# EAGLE design quad-esc (EAGLE 5.11)
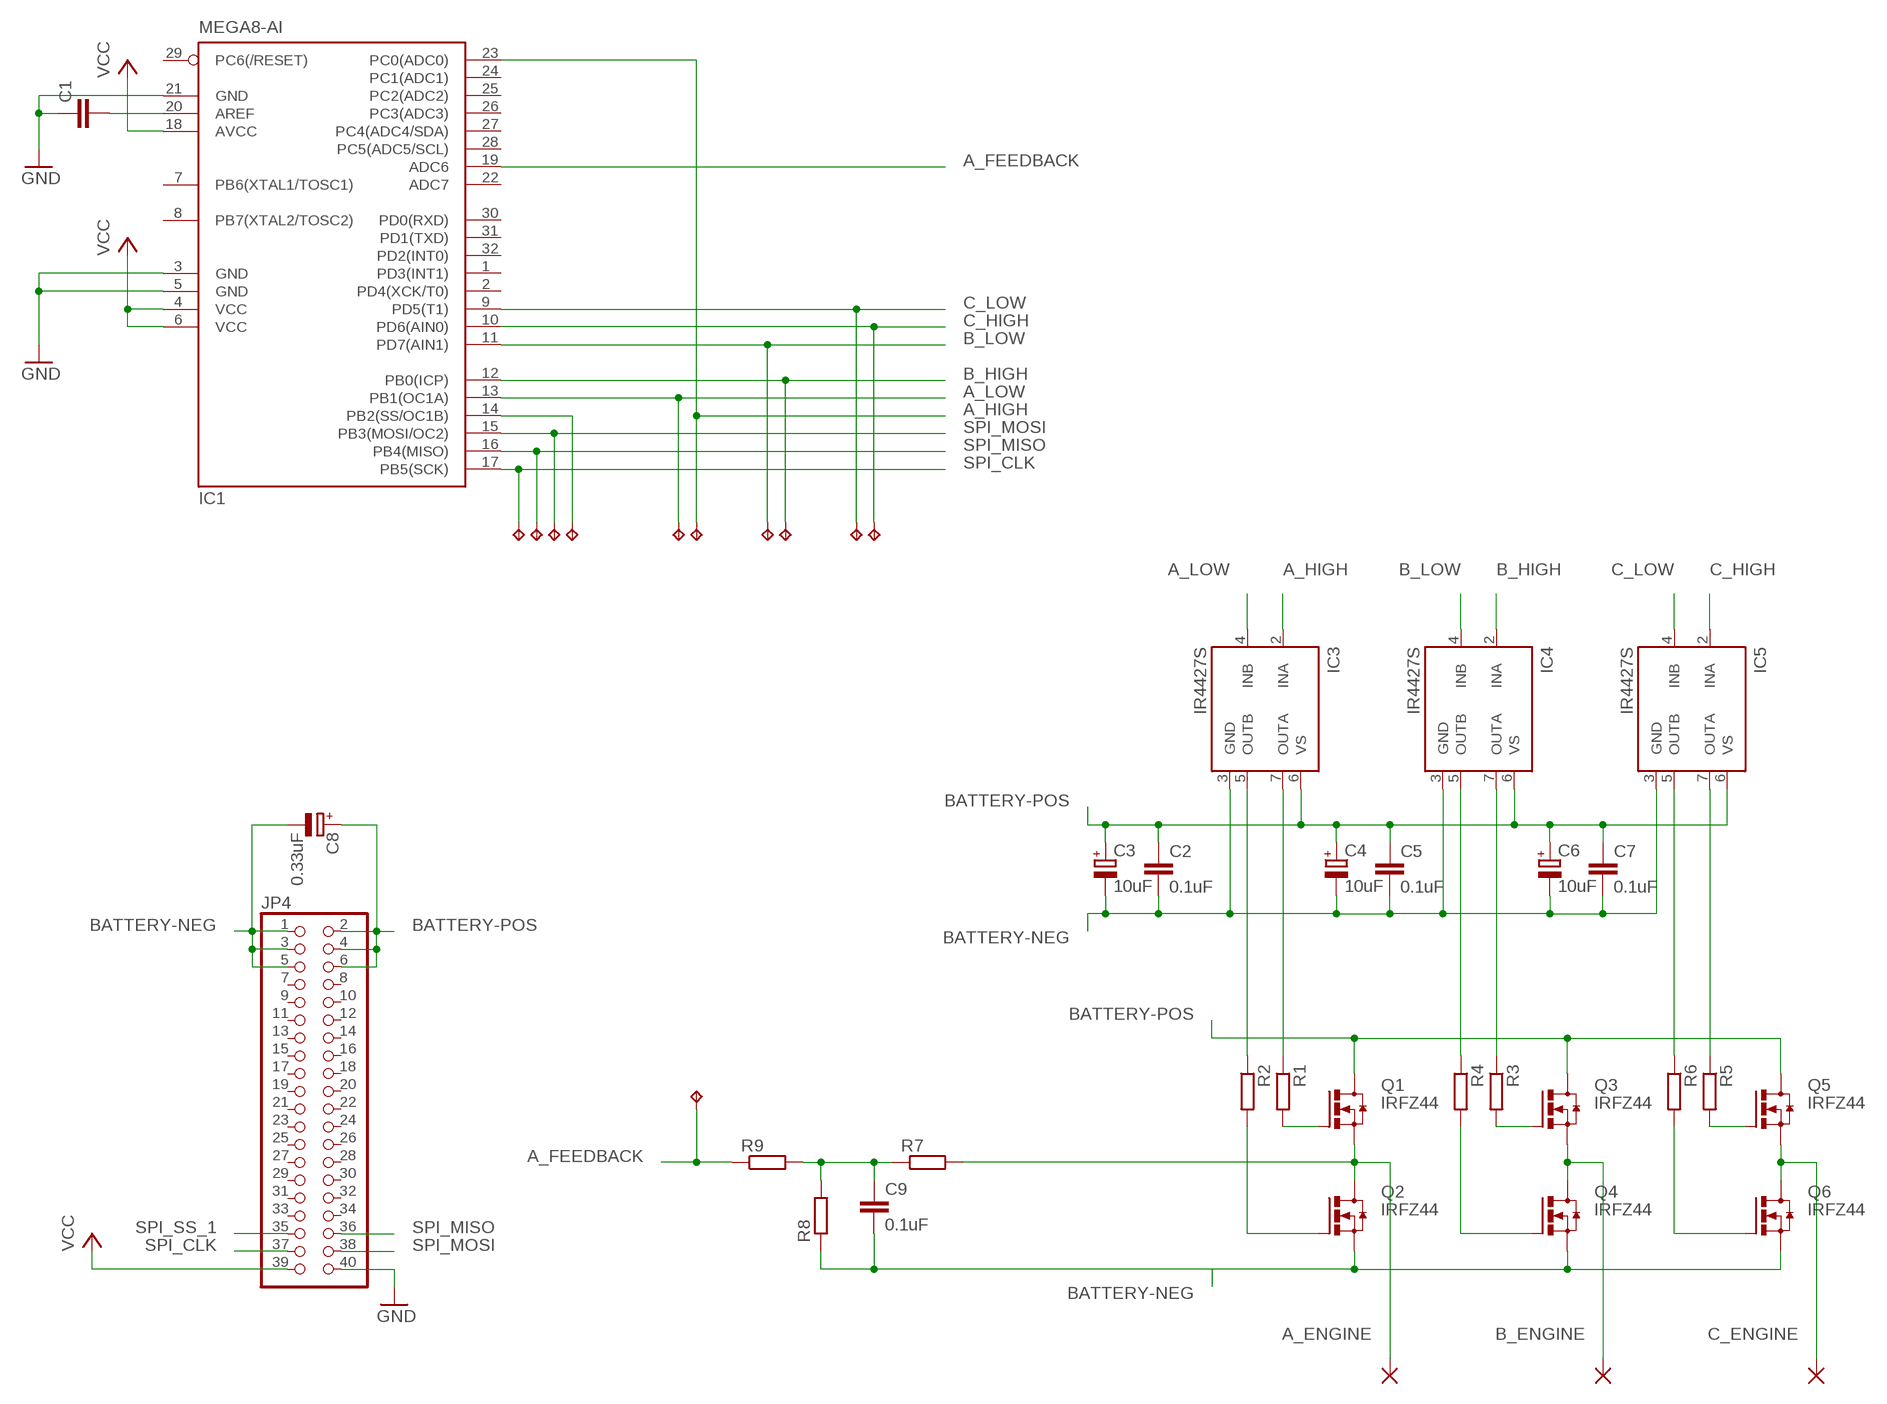
[diagram p0: schematic, sheet 1]

## Parts
A_ENGINE  WIREPADSMD2,54-5,08  [SMD2,54-5,08]
B_ENGINE  WIREPADSMD2,54-5,08  [SMD2,54-5,08]
C1  C-EUC1206  [C1206]
C2  0.1uF  C-EUC0805  [C0805]
C3  10uF  CPOL-EUSMCA  [SMC_A]
C4  10uF  CPOL-EUSMCA  [SMC_A]
C5  0.1uF  C-EUC0805  [C0805]
C6  10uF  CPOL-EUSMCA  [SMC_A]
C7  0.1uF  C-EUC0805  [C0805]
C8  0.33uF  CPOL-EUSMCA  [SMC_A]
C9  0.1uF  C-EUC0805  [C0805]
C_ENGINE  WIREPADSMD2,54-5,08  [SMD2,54-5,08]
IC1  MEGA8-AI  [TQFP32-08]
IC3  IR4427S  [SO08]
IC4  IR4427S  [SO08]
IC5  IR4427S  [SO08]
JP4  PINHD-2X20  [2X20]
Q1  IRFZ44  [TO220BV]
Q2  IRFZ44  [TO220BV]
Q3  IRFZ44  [TO220BV]
Q4  IRFZ44  [TO220BV]
Q5  IRFZ44  [TO220BV]
Q6  IRFZ44  [TO220BV]
R1  R-EU_R1206  [R1206]
R2  R-EU_R1206  [R1206]
R3  R-EU_R1206  [R1206]
R4  R-EU_R1206  [R1206]
R5  R-EU_R1206  [R1206]
R6  R-EU_R1206  [R1206]
R7  R-EU_R1206  [R1206]
R8  R-EU_R1206  [R1206]
R9  R-EU_R1206  [R1206]
TP1  TPPAD1-13  [P1-13]
TP2  TPPAD1-13  [P1-13]
TP3  TPPAD1-13  [P1-13]
TP4  TPPAD1-13  [P1-13]
TP5  TPPAD1-13  [P1-13]
TP6  TPPAD1-13  [P1-13]
TP7  TPPAD1-13  [P1-13]
TP8  TPPAD1-13  [P1-13]
TP9  TPPAD1-13  [P1-13]
TP10  TPPAD1-13  [P1-13]
TP11  TPPAD1-13  [P1-13]

## Nets
A_ENGINE: A_ENGINE.1(P) Q1.3(S) Q2.2(D) R7.2
A_FEEDBACK: IC1.19(ADC6) R9.1 TP7.TP
A_HIGH: IC1.23(PC0(ADC0)) IC3.2(INA) TP2.TP
A_LOW: IC1.13(PB1(OC1A)) IC3.4(INB) TP1.TP
B_ENGINE [battery]: B_ENGINE.1(P) Q3.3(S) Q4.2(D)
B_HIGH: IC1.12(PB0(ICP)) IC4.2(INA) TP4.TP
B_LOW: IC1.11(PD7(AIN1)) IC4.4(INB) TP3.TP
BATTERY-NEG: C2.2 C3.- C4.- C5.2 C6.- C7.2 C8.- C9.2 IC3.3(GND) IC4.3(GND) IC5.3(GND) JP4.1 JP4.3 JP4.5 Q2.3(S) Q4.3(S) Q6.3(S) R8.1
BATTERY-POS: C2.1 C3.+ C4.+ C5.1 C6.+ C7.1 C8.+ IC3.6(VS) IC4.6(VS) IC5.6(VS) JP4.2 JP4.4 JP4.6 Q1.2(D) Q3.2(D) Q5.2(D)
C_ENGINE [battery]: C_ENGINE.1(P) Q5.3(S) Q6.2(D)
C_HIGH: IC1.10(PD6(AIN0)) IC5.2(INA) TP6.TP
C_LOW: IC1.9(PD5(T1)) IC5.4(INB) TP5.TP
GND: C1.1 IC1.3(GND) IC1.5(GND) IC1.21(GND) JP4.40
N$1: C1.2 IC1.20(AREF)
N$2: Q4.1(G) R4.2
N$3: Q3.1(G) R3.2
N$4: IC3.5(OUTB) R2.1
N$5: C9.1 R7.1 R8.2 R9.2
N$7: IC4.5(OUTB) R4.1
N$8: IC4.7(OUTA) R3.1
N$11: IC5.5(OUTB) R6.1
N$12: IC5.7(OUTA) R5.1
N$14: IC3.7(OUTA) R1.1
N$15: Q2.1(G) R2.2
N$16: Q5.1(G) R5.2
N$17: Q6.1(G) R6.2
N$18: Q1.1(G) R1.2
SPI_CLK: IC1.17(PB5(SCK)) JP4.37 TP8.TP
SPI_MISO: IC1.16(PB4(MISO)) JP4.36 TP9.TP
SPI_MOSI: IC1.15(PB3(MOSI/OC2)) JP4.38 TP10.TP
SPI_SS_1: IC1.14(PB2(SS/OC1B)) JP4.35 TP11.TP
VCC: IC1.4(VCC) IC1.6(VCC) IC1.18(AVCC) JP4.39
Unconnected: IC1.1(PD3(INT1)) IC1.2(PD4(XCK/T0)) IC1.7(PB6(XTAL1/TOSC1)) IC1.8(PB7(XTAL2/TOSC2)) IC1.22(ADC7) IC1.24(PC1(ADC1)) IC1.25(PC2(ADC2)) IC1.26(PC3(ADC3)) IC1.27(PC4(ADC4/SDA)) IC1.28(PC5(ADC5/SCL)) IC1.29(PC6(/RESET)) IC1.30(PD0(RXD)) IC1.31(PD1(TXD)) IC1.32(PD2(INT0)) JP4.7 JP4.8 JP4.9 JP4.10 JP4.11 JP4.12 JP4.13 JP4.14 JP4.15 JP4.16 JP4.17 JP4.18 JP4.19 JP4.20 JP4.21 JP4.22 JP4.23 JP4.24 JP4.25 JP4.26 JP4.27 JP4.28 JP4.29 JP4.30 JP4.31 JP4.32 JP4.33 JP4.34

## Library data of the parts
A_ENGINE B_ENGINE C_ENGINE = wirepad:WIREPAD: Wire PAD connect wire on PCB
C1 = rcl:C-EU: CAPACITOR, European symbol
C2 C5 C7 C9 = resistor:C-EU: CAPACITOR, European symbol
C3 C4 C6 C8 = resistor:CPOL-EU: POLARIZED CAPACITOR, European symbol
IC1 = atmel:MEGA8: MICROCONTROLLER 8 Kbytes FLASH, 1 kbytes SRAM, 512 bytes EEPROM, USART, 6-channel 10 bit ADC, 2-channel 8 bit ADC Pin compatible with Atmega48, ATMega88, ATMega168 Source: avr.lbr; MPN: ATMEGA8-16AU; OC_FARNELL: 9171371; OC_NEWARK: 73M8863
IC3-IC5 = ir:IR4427: DUAL LOW SIDE DRIVER Source: ID4426.pdf; MF: INTERNATIONAL RECTIFIER(IR); MPN: IR4427STRPBF; OC_FARNELL: 8639094; OC_NEWARK: 63J7933
JP4 = pinhead:PINHD-2X20: PIN HEADER
Q1-Q6 = irf:IRFZ44: 50A, 60V, N-Channel Power MOSFET
R1-R9 = resistor:R-EU_: RESISTOR, European symbol
TP1-TP11 = testpad:TP: Test pad

## Net classes
0 default: drill 0.61 mm
1 battery: width 1.27 mm

## Board
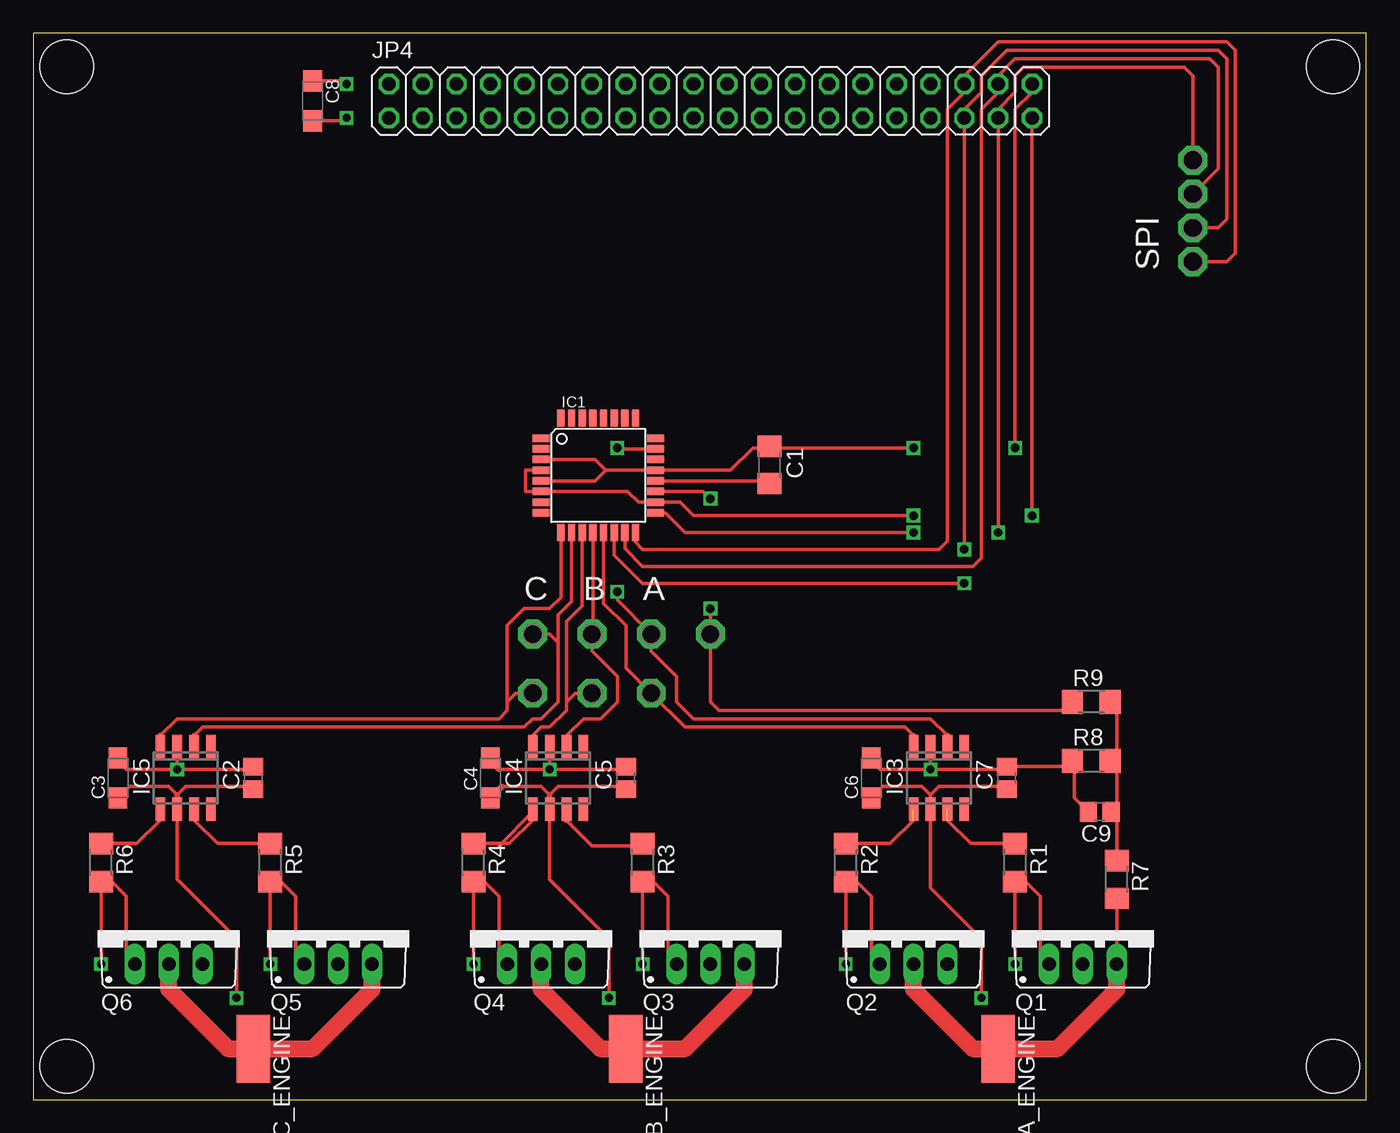
[diagram p1: board, top side]
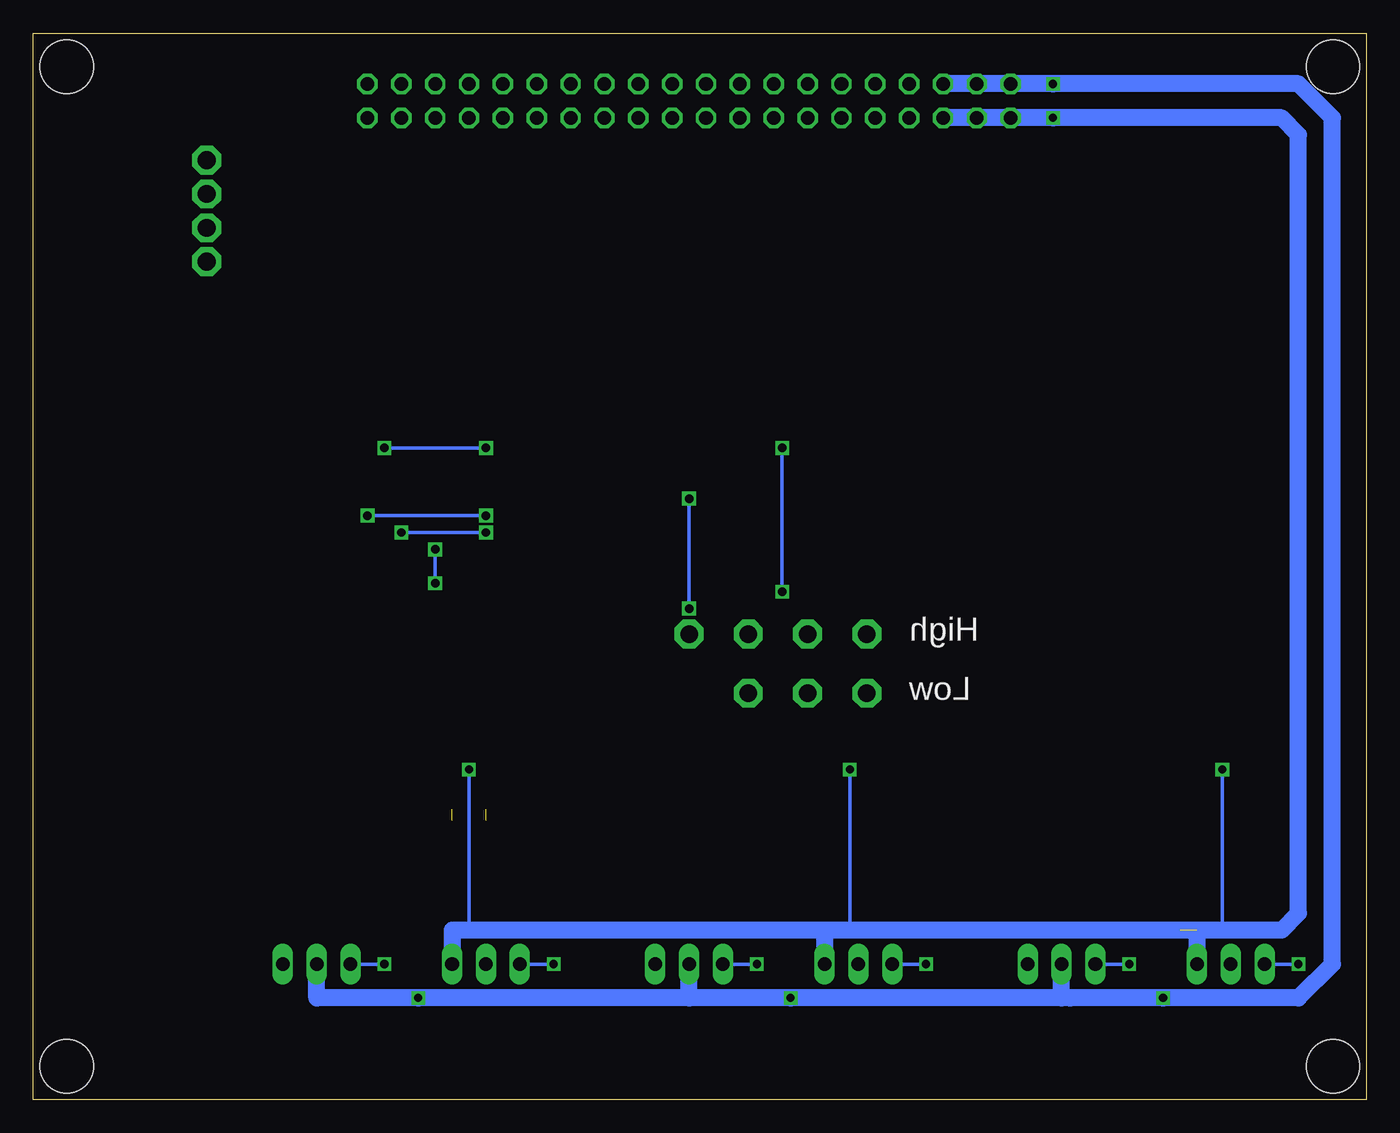
[diagram p2: board, bottom side, seen from below]

Size 100 x 80 mm. Coordinates in mm from the lower left corner, seen from the top.
Outline: 0,0 100,0 100,80 0,80 0,0
Copper layers (1*16): Top 0.035mm / dielectric 1.5mm / Bottom 0.035mm
Design rules "default": minimum track width 10mil, minimum drill 24mil, track to track 8mil, track to pad 8mil, pad to pad 8mil, via to via 8mil, smd to smd 8mil, copper to edge 40mil, drill to drill 8mil, minimum pad ring 10mil, minimum via ring 8mil, stop-mask expansion 4mil, vias tented up to drill 0mil, thermal gap 10mil
Holes 4 mm at 97.5,2.5 2.5,2.5 2.5,77.5 97.5,77.5

### Footprints (pad centres in the part's own frame; a part is rotated, then mirrored left to right if it is on the bottom)
SMD2,54-5,08 = smd 2.54 x 5.08: 1 0,0
C1206 = smd 1.6 x 1.8: 1 -1.4,0; 2 1.4,0
C0805 = smd 1.3 x 1.5: 1 -0.85,0; 2 0.85,0
SMC_A = smd 1.6 x 1.4: + -1.5,0; - 1.5,0
TQFP32-08 = smd 1.27 x 0.559: 1 -4.293,2.8; 2 -4.293,2; 3 -4.293,1.2; 4 -4.293,0.4; 5 -4.293,-0.4; 6 -4.293,-1.2; 7 -4.293,-2; 8 -4.293,-2.8; 17 4.293,-2.8; 18 4.293,-2; 19 4.293,-1.2; 20 4.293,-0.4; 21 4.293,0.4; 22 4.293,1.2; 23 4.293,2; 24 4.293,2.8 | smd 0.559 x 1.27: 9 -2.8,-4.293; 10 -2,-4.293; 11 -1.2,-4.293; 12 -0.4,-4.293; 13 0.4,-4.293; 14 1.2,-4.293; 15 2,-4.293; 16 2.8,-4.293; 25 2.8,4.293; 26 2,4.293; 27 1.2,4.293; 28 0.4,4.293; 29 -0.4,4.293; 30 -1.2,4.293; 31 -2,4.293; 32 -2.8,4.293
SO08 = smd 0.72 x 1.78: 1 -1.905,-2.35; 2 -0.635,-2.35; 3 0.635,-2.35; 4 1.905,-2.35; 5 1.905,2.35; 6 0.635,2.35; 7 -0.635,2.35; 8 -1.905,2.35
2X20 = drill 1.016 octagon: 1 -24.13,-1.27; 2 -24.13,1.27; 3 -21.59,-1.27; 4 -21.59,1.27; 5 -19.05,-1.27; 6 -19.05,1.27; 7 -16.51,-1.27; 8 -16.51,1.27; 9 -13.97,-1.27; 10 -13.97,1.27; 11 -11.43,-1.27; 12 -11.43,1.27; 13 -8.89,-1.27; 14 -8.89,1.27; 15 -6.35,-1.27; 16 -6.35,1.27; 17 -3.81,-1.27; 18 -3.81,1.27; 19 -1.27,-1.27; 20 -1.27,1.27; 21 1.27,-1.27; 22 1.27,1.27; 23 3.81,-1.27; 24 3.81,1.27; 25 6.35,-1.27; 26 6.35,1.27; 27 8.89,-1.27; 28 8.89,1.27; 29 11.43,-1.27; 30 11.43,1.27; 31 13.97,-1.27; 32 13.97,1.27; 33 16.51,-1.27; 34 16.51,1.27; 35 19.05,-1.27; 36 19.05,1.27; 37 21.59,-1.27; 38 21.59,1.27; 39 24.13,-1.27; 40 24.13,1.27
TO220BV = drill 1.016 long: 1 -2.54,-2.54; 2 0,-2.54; 3 2.54,-2.54
R1206 = smd 1.6 x 1.803: 1 -1.422,0; 2 1.422,0
P1-13 = drill 1.321 pad 2.159 octagon: TP 0,0

### Placement (x,y rotation side)
A_ENGINE  72.39,3.81 180 top
B_ENGINE  44.45,3.81 180 top
C1  55.24,47.62 270 top
C2  16.51,24.13 90 top
C3  6.35,24.13 90 top
C4  34.29,24.13 90 top
C5  44.45,24.13 90 top
C6  62.87,24.13 90 top
C7  73.03,24.13 90 top
C8  20.95,74.93 270 top
C9  80.01,21.59 180 top
C_ENGINE  16.51,3.81 180 top
IC1  42.38,46.83 0 top
IC3  67.94,24.13 180 top
IC4  39.37,24.13 180 top
IC5  11.43,24.13 180 top
JP4  50.8,74.93 0 top
Q1  78.74,12.7 0 top
Q2  66.04,12.7 0 top
Q3  50.8,12.7 0 top
Q4  38.1,12.7 0 top
Q5  22.86,12.7 0 top
Q6  10.16,12.7 0 top
R1  73.66,17.78 270 top
R2  60.96,17.78 270 top
R3  45.72,17.78 270 top
R4  33.02,17.78 270 top
R5  17.78,17.78 270 top
R6  5.08,17.78 270 top
R7  81.28,16.51 270 top
R8  79.38,25.4 0 top
R9  79.38,29.84 0 top
TP1  46.35,30.48 0 top
TP2  46.35,34.92 0 top
TP3  41.91,30.48 0 top
TP4  41.91,34.92 0 top
TP5  37.47,30.48 0 top
TP6  37.47,34.92 0 top
TP7  50.8,34.92 0 top
TP8  87,70.48 90 top
TP9  87,62.87 90 top
TP10  87,67.94 90 top
TP11  87,65.41 90 top

### Tracks (layer width: path | path; a pad name or v marks a point on that pad's centre or on a via)
A_ENGINE
  Top 0.254: Q1.3 R7.2
  Top 1.27: Q2.2 66.04,8.26 70.48,3.81 A_ENGINE.1 76.83,3.81 81.28,8.26 Q1.3
A_FEEDBACK  (via drill 0.64)
  Top 0.254: 77.47,29.21 51.44,29.21 50.8,29.84 TP7.TP v50.8,36.83 | IC1.19 50.26,45.62 v50.8,45.09
  Top 0.406: R9.1 77.95,29.69 77.47,29.21
  Bottom 0.254: v50.8,36.83 v50.8,45.09
A_HIGH  (via drill 0.64)
  Top 0.254: 68.58,27.3 67.31,28.57 49.53,28.57 48.26,29.84 48.26,31.75 46.35,33.66 TP2.TP 43.81,37.47 v43.81,38.1 | IC1.23 43.88,48.83 v43.81,48.9
  Top 0.406: 68.58,27.3 IC3.2
  Bottom 0.254: v43.81,38.1 v43.81,48.9
A_LOW
  Top 0.254: 66.04,27.3 65.41,27.94 48.9,27.94 TP1.TP 44.45,32.38 44.45,35.56 42.78,37.23 IC1.13
  Top 0.406: 66.04,27.3 IC3.4
B_ENGINE
  Top 1.27: Q4.2 38.1,8.26 42.55,3.81 B_ENGINE.1 48.9,3.81 53.34,8.26 Q3.3
B_HIGH
  Top 0.254: IC4.2 40.01,27.3 41.27,28.57 42.55,28.57 43.81,29.84 43.81,31.75 41.91,33.66 TP4.TP 41.98,34.99 IC1.12
B_LOW
  Top 0.254: IC4.4 37.47,27.3 38.1,27.94 38.73,27.94 40.01,29.21 40.01,29.84 | TP3.TP 40.64,30.48 40.01,29.84 | 40.01,29.84 40.01,35.87 41.18,37.05 IC1.11
BATTERY-NEG  (via drill 0.61, 0.61 pad 0.25)  (1 unrouted)
  Top 0.254: 6.35,25.4 6.99,24.77 v10.79,24.77 | v10.79,24.77 IC5.3 | v38.73,24.77 34.92,24.77 | v38.73,24.77 IC4.3 | v38.73,24.77 44.23,24.77 | 62.87,25.4 63.5,24.77 v67.31,24.77 | v67.31,24.77 72.81,24.77 | v67.31,24.77 IC3.3 | 23.5,73.43 C8.- | C7.2 77.95,24.98 | 78.11,25.4 78.11,22.64 C9.2 | v10.79,24.77 16.3,24.77
  Top 0.406: 72.81,24.77 C7.2 | 16.3,24.77 C2.2 | 6.35,25.4 C3.- | C4.- 34.29,25.4 34.92,24.77 | 44.23,24.77 C5.2 | 62.87,25.4 C6.- | v23.5,73.66 23.5,73.43 | 77.95,24.98 R8.1 78.11,25.4
  Bottom 0.254: 38.73,12.7 v38.73,24.77 | 10.79,12.7 v10.79,24.77 | 67.31,12.7 v67.31,24.77
  Bottom 1.27: 40.64,12.7 Q4.3 | Q2.3 68.58,12.7 67.31,12.7 40.64,12.7 | 40.64,12.7 38.73,12.7 13.97,12.7 | 12.7,12.7 15.24,12.7 | 12.7,12.7 10.79,12.7 6.35,12.7 5.08,13.97 5.08,72.39 6.35,73.66 v23.5,73.66 JP4.1 JP4.3 JP4.5 | 12.7,12.7 Q6.3
BATTERY-POS  (via drill 0.61)
  Top 0.254: IC4.6 38.73,16.51 43.18,12.06 v43.18,7.62 | v71.12,7.62 71.12,12.06 67.31,15.88 IC3.6 67.31,22.86 | IC5.6 10.79,16.51 15.24,12.06 v15.24,7.62 | 67.31,22.86 67.94,23.5 72.81,23.5 | 44.23,23.5 39.37,23.5 38.73,22.86 38.1,23.5 35.16,23.5 | C3.+ 7.21,23.5 10.16,23.5 10.79,22.86 11.43,23.5 16.3,23.5 | 67.31,22.86 66.67,23.5 63.73,23.5 C6.+ | 23.5,76.43 C8.+
  Top 0.406: 16.3,23.5 C2.1 | IC4.6 38.73,22.86 | 72.81,23.5 C7.1 | 44.23,23.5 C5.1 | 35.16,23.5 C4.+ | v23.5,76.2 23.5,76.43 | IC5.6 10.79,22.86
  Bottom 0.406: Q5.2 22.86,8.26 22.23,7.62
  Bottom 1.27: 22.86,7.62 Q5.2 | 50.8,7.62 Q3.2 | Q1.2 78.74,7.62 v71.12,7.62 50.8,7.62 | 22.86,7.62 v43.18,7.62 50.8,7.62 | 22.86,7.62 22.23,7.62 v15.24,7.62 5.08,7.62 2.54,10.16 2.54,73.66 5.08,76.2 v23.5,76.2 JP4.2 JP4.4 JP4.6
C_ENGINE
  Top 1.27: Q6.2 10.16,8.26 14.61,3.81 C_ENGINE.1 20.95,3.81 25.4,8.26 Q5.3
C_HIGH
  Top 0.254: 12.06,27.3 12.7,27.94 36.83,27.94 37.47,28.57 38.1,28.57 39.37,29.84 39.37,34.29 | 39.37,34.29 39.37,36.35 40.38,37.36 IC1.10 | TP6.TP 38.73,34.92 39.37,34.29
  Top 0.406: IC5.2 12.06,27.3
C_LOW
  Top 0.254: 9.53,27.3 10.79,28.57 34.92,28.57 35.56,29.21 35.56,29.84 | IC1.9 39.58,37.67 38.73,36.83 36.83,36.83 35.56,35.56 35.56,29.84 | TP5.TP 36.2,30.48 35.56,29.84
  Top 0.406: IC5.4 9.53,27.3
GND  (via drill 0.64)
  Top 0.254: 42.95,47.23 IC1.21 52.3,47.23 53.98,48.9 55.12,48.9 C1.1 55.24,48.9 v66.04,48.9 | IC1.3 42.15,48.02 42.95,47.23 | IC1.5 42.16,46.42 42.87,47.13 42.95,47.23 | v73.66,48.9 73.66,74.3 74.96,75.6 74.96,76.17 JP4.40
  Bottom 0.254: v66.04,48.9 v73.66,48.9
N$1
  Top 0.254: IC1.20 54.54,46.42 54.61,46.35 55.24,46.35 C1.2
N$2  (via drill 0.61)
  Top 0.254: v33.02,10.16 R4.2 33.66,16.51 34.92,15.24 34.92,10.16 Q4.1
  Top 0.406: R4.2 33.02,16.51
  Bottom 0.254: v33.02,10.16 Q4.1
N$3  (via drill 0.61)
  Top 0.254: v45.72,10.16 R3.2 46.35,16.51 47.62,15.24 47.62,10.16 Q3.1
  Top 0.406: R3.2 45.72,16.51
  Bottom 0.254: v45.72,10.16 Q3.1
N$4  (1 unrouted)
  Top 0.254: R2.1 64.29,19.2 66.04,20.95
N$5
  Top 0.254: R7.1 81.28,21.59 81.28,25.4 81.28,29.84
  Top 0.406: C9.1 81.28,21.59 | 81.28,25.4 R8.2 | 81.28,29.84 R9.2
N$7
  Top 0.254: R4.1 34.92,19.2 | 34.92,19.2 35.71,19.2 37.47,20.95 | IC4.5 37.47,21.59 34.92,19.05 34.92,19.2
N$8
  Top 0.254: 40.01,20.95 41.91,19.05 45.57,19.05
  Top 0.406: IC4.7 40.01,20.95 | 45.57,19.05 R3.1
N$11
  Top 0.254: R6.1 7.77,19.2 9.53,20.95 IC5.5
N$12
  Top 0.254: R5.1 13.82,19.2 12.06,20.95 IC5.7
N$14  (1 unrouted)
  Top 0.254: R1.1 70.33,19.2 68.58,20.95
N$15  (via drill 0.61)
  Top 0.254: v60.96,10.16 R2.2 61.59,16.51 62.87,15.24 62.87,10.16 Q2.1
  Top 0.406: R2.2 60.96,16.51
  Bottom 0.254: v60.96,10.16 Q2.1
N$16  (via drill 0.61)
  Top 0.254: v17.78,10.16 R5.2 18.41,16.51 19.68,15.24 19.68,10.16 Q5.1
  Top 0.406: R5.2 17.78,16.51
  Bottom 0.254: v17.78,10.16 Q5.1
N$17  (via drill 0.61)
  Top 0.254: v5.08,10.16 R6.2 5.71,16.51 6.99,15.24 6.99,10.16 Q6.1
  Top 0.406: R6.2 5.08,16.51
  Bottom 0.254: v5.08,10.16 Q6.1
N$18  (via drill 0.61)
  Top 0.254: v73.66,10.16 R1.2 74.3,16.51 75.56,15.24 75.56,10.16 Q1.1
  Top 0.406: R1.2 73.66,16.51
  Bottom 0.254: v73.66,10.16 Q1.1
SPI_CLK  (via drill 0.64)
  Top 0.254: IC1.17 47.41,44.02 48.9,42.55 v66.04,42.55 | v72.39,42.55 JP4.37 72.39,74.3 73.66,75.56 73.66,76.83 74.3,77.47 86.36,77.47 87,76.83 TP8.TP
  Bottom 0.254: v66.04,42.55 v72.39,42.55
SPI_MISO
  Top 0.254: IC1.16 45.18,41.81 45.72,41.27 67.94,41.27 68.58,41.91 68.58,74.29 69.85,75.56 JP4.36 69.85,76.83 72.39,79.38 89.53,79.38 90.17,78.74 90.17,63.5 89.53,62.87 TP9.TP
SPI_MOSI
  Top 0.254: IC1.15 44.38,41.34 45.72,40.01 70.48,40.01 71.12,40.64 71.12,74.32 72.4,75.6 JP4.38 72.39,76.83 73.66,78.11 88.27,78.11 88.9,77.47 88.9,69.85 TP10.TP
SPI_SS_1  (via drill 0.64)
  Top 0.254: IC1.14 43.58,40.88 45.72,38.73 v69.85,38.73 | v69.85,41.27 JP4.35 69.85,74.3 71.12,75.56 71.12,76.83 73.03,78.74 88.9,78.74 89.53,78.11 89.53,66.04 88.9,65.41 TP11.TP
  Bottom 0.254: v69.85,38.73 v69.85,41.27
VCC  (via drill 0.64)
  Top 0.254: IC1.4 36.92,47.23 36.92,45.62 IC1.6 44.59,45.62 45.39,44.83 IC1.18 48.52,44.83 49.53,43.81 v66.04,43.81 | v74.93,43.81 JP4.39
  Bottom 0.254: v66.04,43.81 v74.93,43.81

### Text on the board
tNames: SPI | C | B | A
bNames: High | Low